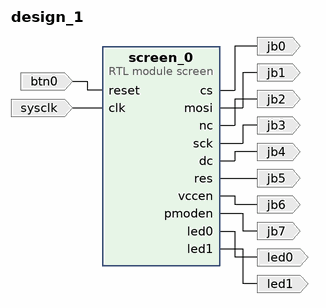
[diagram p0: block diagram of the top level]
# Vivado block design design_1, xc7z020clg400-1, Vivado 2022.2
create_bd_design design_1

create_bd_port -dir I sysclk
create_bd_port -dir I btn0
create_bd_port -dir O led0
create_bd_port -dir O led1
create_bd_port -dir O jb7
create_bd_port -dir O jb6
create_bd_port -dir O jb5
create_bd_port -dir O jb4
create_bd_port -dir O jb3
create_bd_port -dir O jb2
create_bd_port -dir O jb1
create_bd_port -dir O jb0

create_bd_cell -type module -reference screen screen_0

# ---- connections ----

connect_bd_net -net btn0_1 [get_bd_ports btn0] [get_bd_pins screen_0/reset]
connect_bd_net [get_bd_pins screen_0/cs] [get_bd_ports jb0]
connect_bd_net [get_bd_pins screen_0/dc] [get_bd_ports jb4]
connect_bd_net [get_bd_pins screen_0/led0] [get_bd_ports led0]
connect_bd_net [get_bd_pins screen_0/led1] [get_bd_ports led1]
connect_bd_net [get_bd_pins screen_0/mosi] [get_bd_ports jb1]
connect_bd_net [get_bd_pins screen_0/nc] [get_bd_ports jb2]
connect_bd_net [get_bd_pins screen_0/pmoden] [get_bd_ports jb7]
connect_bd_net [get_bd_pins screen_0/res] [get_bd_ports jb5]
connect_bd_net [get_bd_pins screen_0/sck] [get_bd_ports jb3]
connect_bd_net [get_bd_pins screen_0/vccen] [get_bd_ports jb6]
connect_bd_net [get_bd_ports sysclk] [get_bd_pins screen_0/clk]

validate_bd_design
save_bd_design
